# Altium schematic sheet Power.SchDoc
size A4; Organization: Altium Limited; Address1: L3, 12a Rodborough Rd; Address2: Frenchs Forest; Address3: NSW; Address4: Australia 2086; DocumentNumber: 8; SheetNumber: 8; SheetTotal: 8
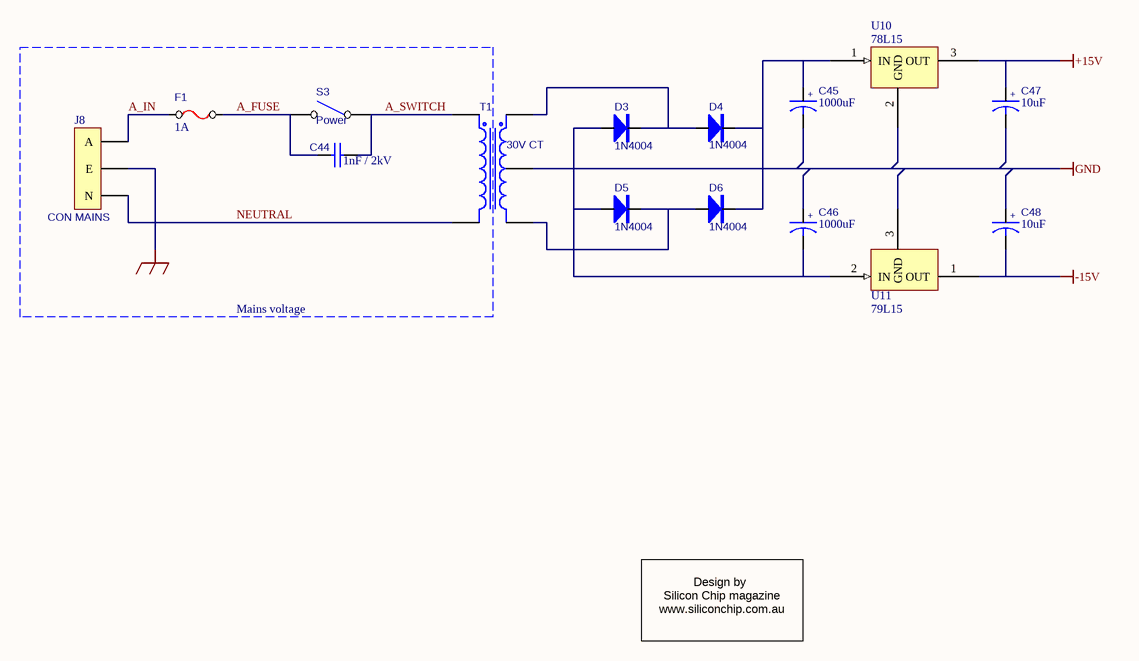
[diagram p0: Power.SchDoc]

## Parts
C44  1nF / 2kV  [RAD0.8]
C45  1000uF  [RB.4/.8]
C46  1000uF  [RB.4/.8]
C47  10uF  [RB.2/.4]
C48  10uF  [RB.2/.4]
D3  1N4004  [DIODE0.5]
D4  1N4004  [DIODE0.5]
D5  1N4004  [DIODE0.5]
D6  1N4004  [DIODE0.5]
F1  1A  [FUSE]
J8  CON MAINS  [IEC-MAINS]
S3  Power  [SW-MAINS]
T1  30V CT  [TRANSFORMER]
U10  78L15  [TO-92A]
U11  79L15  [TO-92A]

## Blocks framed on the sheet
Mains voltage: C44 F1 J8 S3

## Nets
+15V: C47.1 U10.3(OUT)
-15V: C48.2 U11.1(OUT)
CHASSIS: J8.2(E)
GND: C45.2 C46.1 C47.2 C48.1 T1.4(SecCT) U10.2(GND) U11.3(GND)
A_FUSE: C44.2 F1.2 S3.2(NO)
A_IN: F1.1 J8.1(A)
A_SWITCH: C44.1 S3.1(COMMON) T1.1(Pri+)
NEUTRAL: J8.3(N) T1.2(Pri-)
NetC45_1: C45.1 D4.2(K) D6.2(K) U10.1(IN)
NetC46_2: C46.2 D3.1(A) D5.1(A) U11.2(IN)
NetD3_2: D3.2(K) D4.1(A) T1.3(Sec+)
NetD5_2: D5.2(K) D6.1(A) T1.5(Sec-)

## Notes on the sheet
- Design by
  Silicon Chip magazine
  www.siliconchip.com.au
- Title
- Size:
- Date:
- A4
- Number:
- Time:
- Revision:
- Sheet
- of
- File:
- (in symbol CAPACITOR POL) +

## Library data of the parts
C44 = CAP: Capacitor
C45-C48 = CAPACITOR POL: Bi-Polar Capacitor
D3-D6 = 1N4004: Diode
F1 = FUSE
J8 = CON MAINS: Connector
S3 = SW SPST
T1 = 30V CT: Center-Tapped Transformer
U10 = 78L15: Very Low Drop Voltage Regulators With Inhibit
U11 = 79L15: Very Low Drop Voltage Regulators With Inhibit